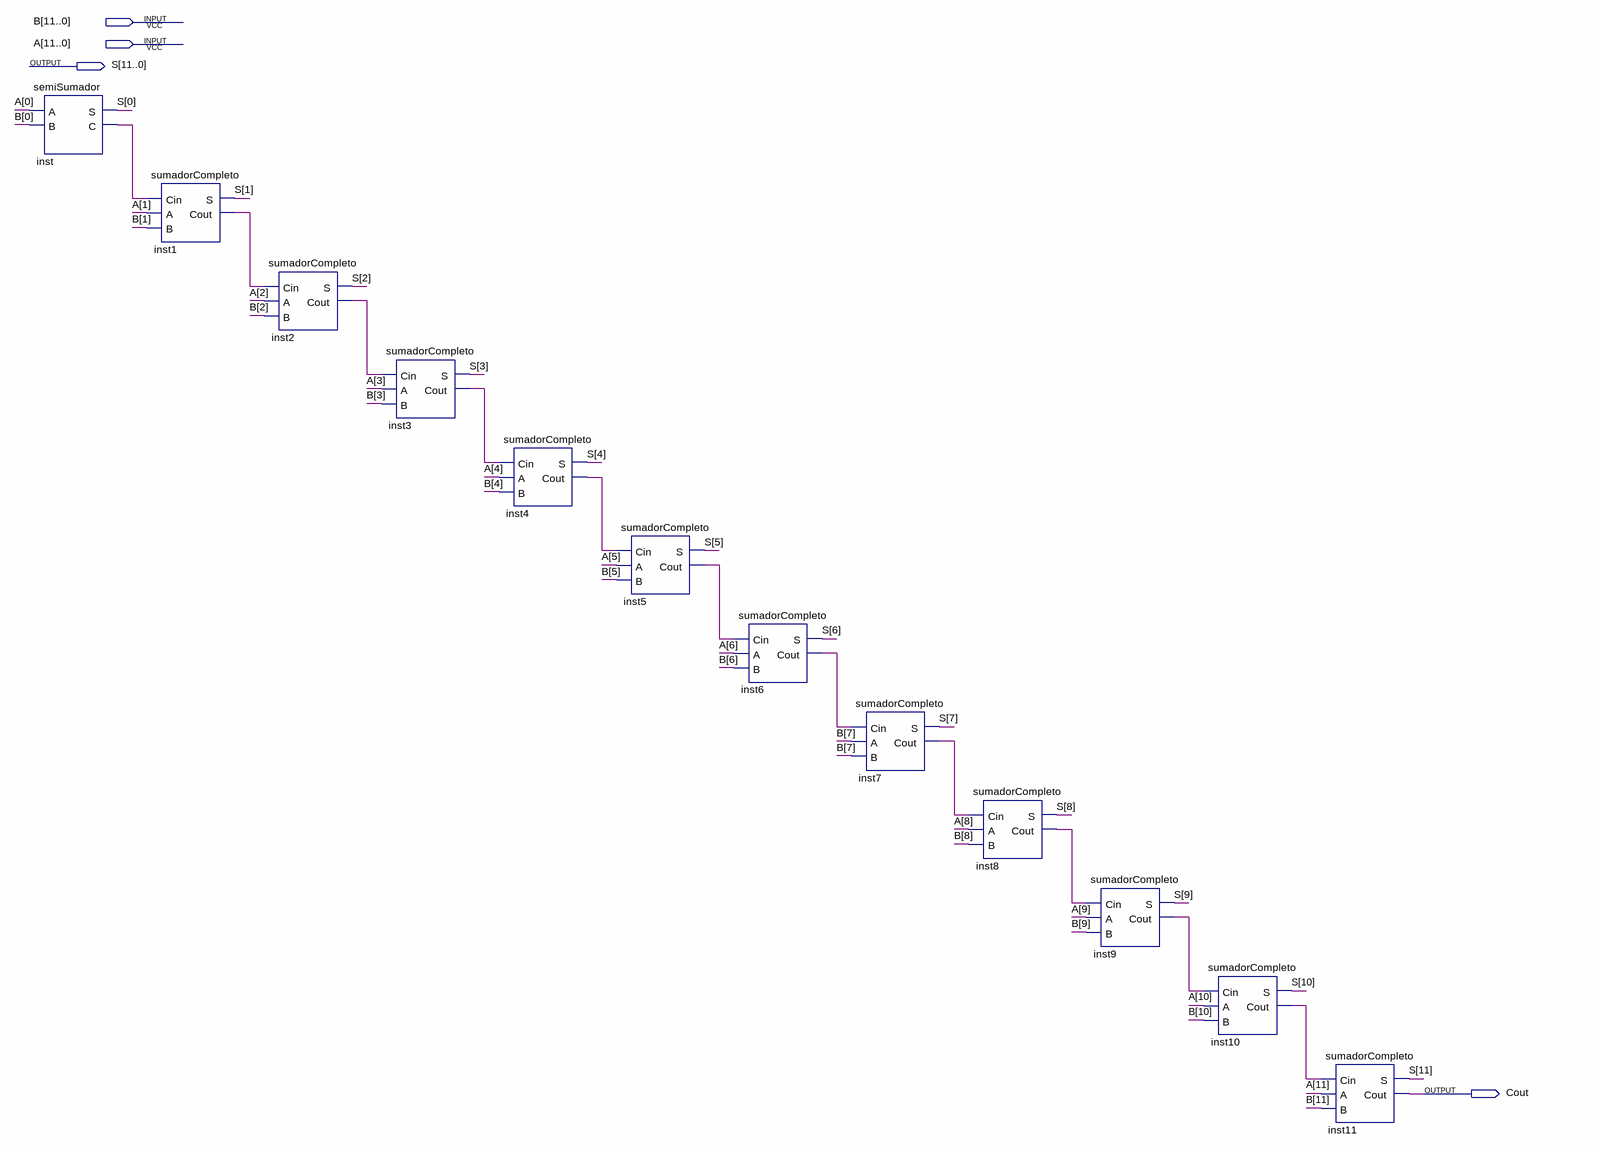
[diagram p0: schematic sheet]
// Quartus schematic sumadorSerie12bits.bdf as structural Verilog: 12 symbols, 4 pins
module sumadorSerie12bits (
  input  [11:0] B,
  input  [11:0] A,
  output [11:0] S,
  output Cout
);

  wire inst1_cout, inst2_cout, inst3_cout, inst4_cout, inst5_cout, inst6_cout, inst7_cout, inst8_cout,
       inst9_cout, inst10_cout, inst_c;

  semiSumador inst (.A(A[0]), .B(B[0]), .S(S[0]), .C(inst_c));
  sumadorCompleto inst1 (.Cin(inst_c), .A(A[1]), .B(B[1]), .S(S[1]), .Cout(inst1_cout));
  sumadorCompleto inst2 (.Cin(inst1_cout), .A(A[2]), .B(B[2]), .S(S[2]), .Cout(inst2_cout));
  sumadorCompleto inst3 (.Cin(inst2_cout), .A(A[3]), .B(B[3]), .S(S[3]), .Cout(inst3_cout));
  sumadorCompleto inst4 (.Cin(inst3_cout), .A(A[4]), .B(B[4]), .S(S[4]), .Cout(inst4_cout));
  sumadorCompleto inst5 (.Cin(inst4_cout), .A(A[5]), .B(B[5]), .S(S[5]), .Cout(inst5_cout));
  sumadorCompleto inst6 (.Cin(inst5_cout), .A(A[6]), .B(B[6]), .S(S[6]), .Cout(inst6_cout));
  sumadorCompleto inst7 (.Cin(inst6_cout), .A(B[7]), .B(B[7]), .S(S[7]), .Cout(inst7_cout));
  sumadorCompleto inst8 (.Cin(inst7_cout), .A(A[8]), .B(B[8]), .S(S[8]), .Cout(inst8_cout));
  sumadorCompleto inst9 (.Cin(inst8_cout), .A(A[9]), .B(B[9]), .S(S[9]), .Cout(inst9_cout));
  sumadorCompleto inst10 (.Cin(inst9_cout), .A(A[10]), .B(B[10]), .S(S[10]), .Cout(inst10_cout));
  sumadorCompleto inst11 (.Cin(inst10_cout), .A(A[11]), .B(B[11]), .S(S[11]), .Cout(Cout));
endmodule
